# EAGLE design SNES_AddOn1Chip (EAGLE 6.5.0)
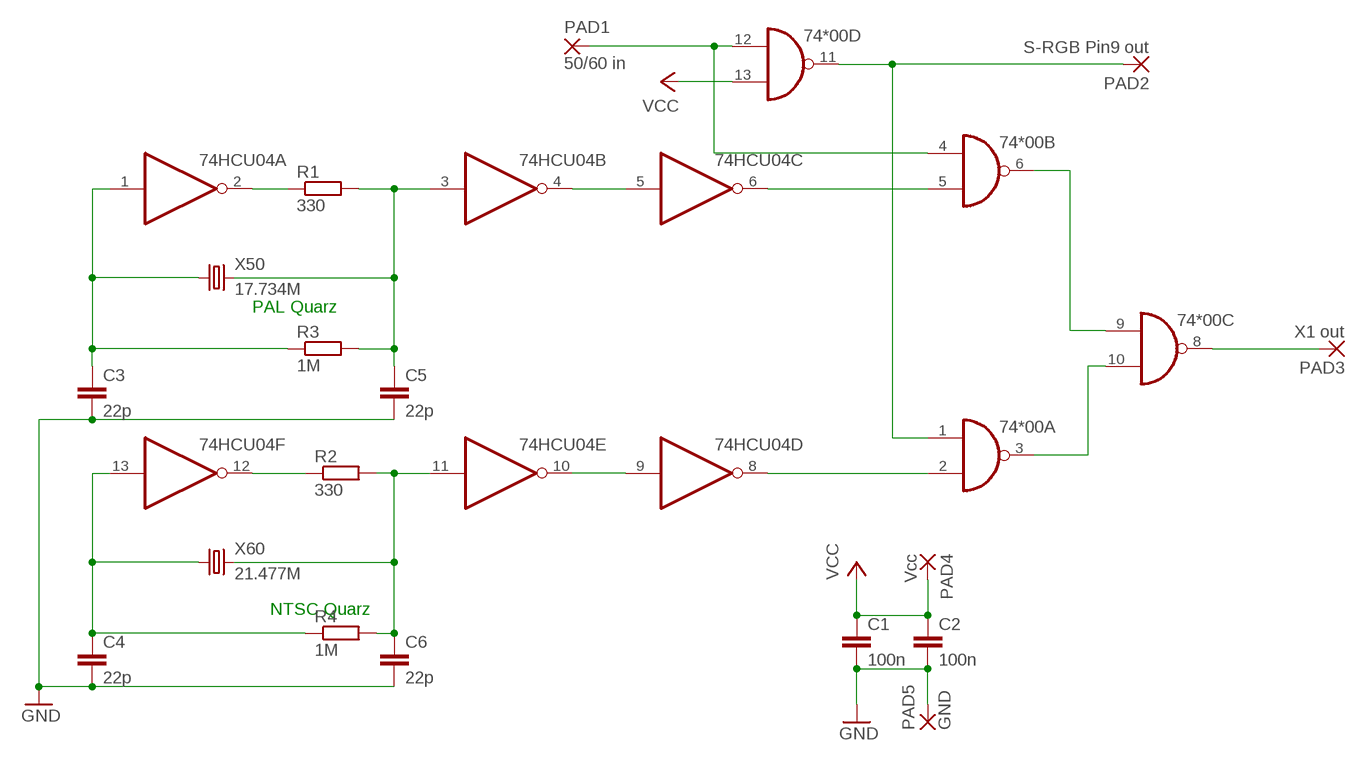
[diagram p0: schematic, sheet 1]

## Parts
74*00  7400D  [SO14]
74HCU04  74HC04D  [SO14]
C1  100n  C0805  [Z0805]
C2  100n  C0805  [Z0805]
C3  22p  C0805  [Z0805]
C4  22p  C0805  [Z0805]
C5  22p  C0805  [Z0805]
C6  22p  C0805  [Z0805]
PAD1  50/60 in  SMD2  [SMD1,27-2,54]
PAD2  S-RGB Pin9 out  SMD2  [SMD1,27-2,54]
PAD3  X1 out  SMD2  [SMD1,27-2,54]
PAD4  Vcc  SMD5  [SMD2,54-5,08]
PAD5  GND  SMD5  [SMD2,54-5,08]
R1  330  R0805  [Z0805]
R2  330  R0805  [Z0805]
R3  1M  R0805  [Z0805]
R4  1M  R0805  [Z0805]
X50  17.734M  CRYSTALHC49S  [HC49/S]
X60  21.477M  CRYSTALHC49S  [HC49/S]

## Nets
GND: C1.2 C2.2 C3.2 C4.2 C5.2 C6.2 PAD5.1(P)
N$27: 74HCU04.1(A:I) C3.1 R3.1 X50.1
N$28: 74HCU04.3(B:I) C5.1 R1.2 R3.2 X50.2
N$29: 74HCU04.13(F:I) C4.1 R4.1 X60.1
N$30: 74HCU04.11(E:I) C6.1 R2.2 R4.2 X60.2
N$31: 74*00.3(A:O) 74*00.10(C:I1)
N$32: 74*00.6(B:O) 74*00.9(C:I0)
N$33: 74*00.4(B:I0) 74*00.12(D:I0) PAD1.1(P)
N$35: 74*00.1(A:I0) 74*00.11(D:O) PAD2.1(P)
N$36: 74*00.8(C:O) PAD3.1(P)
N$37: 74HCU04.2(A:O) R1.1
N$38: 74HCU04.4(B:O) 74HCU04.5(C:I)
N$39: 74*00.5(B:I1) 74HCU04.6(C:O)
N$41: 74*00.2(A:I1) 74HCU04.8(D:O)
N$44: 74HCU04.9(D:I) 74HCU04.10(E:O)
N$50: 74HCU04.12(F:O) R2.1
VCC: 74*00.13(D:I1) C1.1 C2.1 PAD4.1(P)

## Notes on the sheet
- PAL Quarz
- NTSC Quarz

## Power pins joined to a net without a drawn wire
GND: 74*00.7(P:GND) 74HCU04.7(P:GND)
VCC: 74*00.14(P:VCC) 74HCU04.14(P:VCC)

## Library data of the parts
74*00 = 74xx-eu:74*00: Quad 2-input NAND gate
74HCU04 = 74xx-eu:74*04: Hex INVERTER
C1-C6 = snescart:C0805
PAD1-PAD3 = wirepad:SMD2: SMD PAD
PAD4 PAD5 = wirepad:SMD5: SMD PAD
R1-R4 = snescart:R0805
X50 X60 = crystal:CRYSTAL: CRYSTAL; OC_FARNELL: 1667008; OC_NEWARK: unknown

## Board
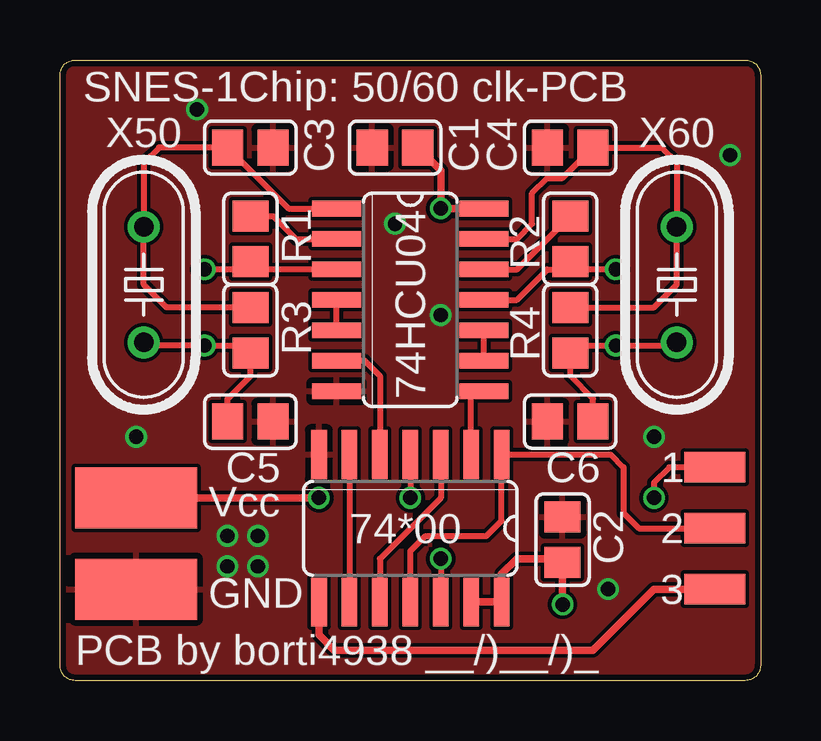
[diagram p1: board, top side]
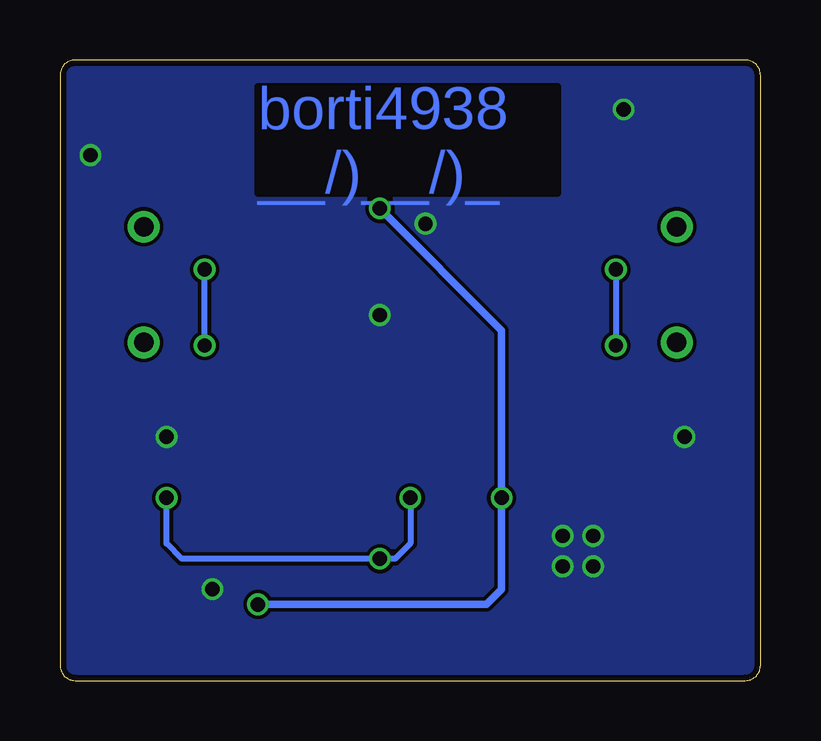
[diagram p2: board, bottom side, seen from below]

Size 29.21 x 25.88 mm. Coordinates in mm from the lower left corner, seen from the top.
Outline: 0.63,0 arc-90 0,0.63 0,25.24 arc-90 0.63,25.88 28.57,25.88 arc-90 29.21,25.24 29.21,0.63 arc-90 28.57,0 0.63,0
Copper layers (1*16): Top 0.035mm / dielectric 1.5mm / Bottom 0.035mm
Design rules "ITEADstudio_DRC": minimum track width 6mil, minimum drill 12mil, track to track 6mil, track to pad 6mil, pad to pad 6mil, via to via 6mil, smd to smd 0mil, copper to edge 10mil, drill to drill 10mil, minimum pad ring 10mil, minimum via ring 6mil, stop-mask expansion 2mil, vias tented up to drill 100mil, thermal gap 10mil

### Footprints (pad centres in the part's own frame; a part is rotated, then mirrored left to right if it is on the bottom)
SO14 = smd 0.66 x 2.032: 1 -3.81,-3.073; 2 -2.54,-3.073; 3 -1.27,-3.073; 4 0,-3.073; 5 1.27,-3.073; 6 2.54,-3.073; 7 3.81,-3.073; 8 3.81,3.073; 9 2.54,3.073; 10 1.27,3.073; 11 0,3.073; 12 -1.27,3.073; 13 -2.54,3.073; 14 -3.81,3.073
Z0805 = smd 1.3 x 1.5: 1 -0.95,0; 2 0.95,0
SMD1,27-2,54 = smd 1.27 x 2.54: 1 0,0
SMD2,54-5,08 = smd 2.54 x 5.08: 1 0,0
HC49/S = drill 0.813: 1 -2.413,0; 2 2.413,0

### Placement (x,y rotation side)
74*00  14.61,6.35 180 top
74HCU04  14.61,15.87 270 top
C1  13.97,22.22 180 top
C2  20.96,5.87 90 top
C3  7.94,22.22 0 top
C4  21.27,22.22 180 top
C5  7.94,10.79 0 top
C6  21.27,10.79 180 top
PAD1  27.3,8.89 90 top
PAD2  27.3,6.35 90 top
PAD3  27.3,3.81 90 top
PAD4  3.18,7.62 90 top
PAD5  3.18,3.81 90 top
R1  7.94,18.42 270 top
R2  21.27,18.42 270 top
R3  7.94,14.61 270 top
R4  21.27,14.61 270 top
X50  3.49,16.51 270 top
X60  25.72,16.51 270 top

### Tracks (layer width: path | path; a pad name or v marks a point on that pad's centre or on a via)
GND  (via drill 0.6)
  other vias: 6.98,4.76 15.88,15.24 13.97,19.05 27.94,21.91 3.18,10.16 24.76,10.16 22.86,3.81 5.71,23.81 6.98,6.03 8.25,4.76 8.25,6.03
  pour Top: -1.91,-1.27 31.11,-1.27 31.11,26.67 -1.91,26.67
  pour Bottom: -1.91,-1.27 31.11,-1.27 31.11,26.67 -1.91,26.67
N$27
  Top 0.254: R3.1 4.45,15.55 3.49,16.51 X50.1 3.49,21.59 4.13,22.22 C3.1 9.52,19.68 74HCU04.1
N$28  (via drill 0.6)
  Top 0.254: 74HCU04.3 8.26,17.14 | 8.26,17.14 R1.2 | 8.26,17.14 v6.03,17.14 | X50.2 3.62,13.97 v6.03,13.97 7.62,13.97 R3.2 7.94,12.7 6.99,11.75 C5.1
  Bottom 0.254: v6.03,17.14 v6.03,13.97
N$29
  Top 0.254: R4.1 24.76,15.55 25.72,16.51 X60.1 25.72,21.59 25.08,22.22 C4.1 20.95,20.96 20.32,20.96 19.68,20.32 19.68,19.05 19.05,18.42 74HCU04.13
N$30  (via drill 0.6)
  Top 0.254: R2.2 21.27,17.14 20.96,17.14 | v23.18,17.14 21.59,17.14 R2.2 | X60.2 25.59,13.97 v23.18,13.97 21.27,13.97 R4.2 21.27,12.7 22.22,11.75 C6.1 | 74HCU04.11 19.05,15.87 20.32,17.14 20.95,17.14 R2.2
  Bottom 0.254: v23.18,13.97 v23.18,17.14
N$31
  Top 0.254: 74*00.3 15.88,7.62 13.34,5.08 74*00.10
N$32
  Top 0.254: 74*00.6 74*00.9
N$33  (via drill 0.6)
  Top 0.254: v15.88,5.08 74*00.12 | 74*00.4 v14.61,7.62 | PAD1.1 25.4,8.89 24.76,8.25 v24.76,7.62
  Bottom 0.254: v14.61,7.62 14.61,5.71 15.24,5.08 v15.88,5.08 24.13,5.08 24.76,5.71 v24.76,7.62
N$35
  Top 0.254: 74*00.11 14.61,5.4 15.24,6.03 17.78,6.03 18.42,6.67 74*00.1 22.96,9.42 23.5,8.89 23.5,6.98 24.13,6.35 PAD2.1
N$36
  Top 0.305: PAD3.1 24.76,3.81 22.22,1.27 11.43,1.27 10.79,1.9 74*00.8
N$37
  Top 0.254: R1.1 8.89,19.36 9.84,18.42 74HCU04.2
N$38
  Top 0.254: 74HCU04.5 74HCU04.4
N$39
  Top 0.254: 74HCU04.6 12.7,13.33 13.34,12.7 74*00.5
N$41
  Top 0.254: 74*00.2 17.14,12.06 74HCU04.8
N$44
  Top 0.254: 74HCU04.9 74HCU04.10
N$50
  Top 0.254: 74HCU04.12 19.05,17.14 R2.1
VCC  (via drill 0.6)
  Top 0.305: 74*00.13 74*00.14 18.42,4.45 19.05,5.08 20.64,5.08 C2.1 v20.96,3.18 | 74HCU04.14 v15.88,19.68 15.88,21.27 C1.1 | PAD4.1 v10.79,7.62
  Bottom 0.305: v20.96,3.18 11.43,3.18 10.79,3.81 v10.79,7.62 10.79,14.61 v15.88,19.68

### Text on the board
Bottom: borti4938 / __/)__/)_
tNames: SNES-1Chip: 50/60 clk-PCB | C3 | C1 | C4 | X50 | X60 | R1 | R2 | R3 | R4 | 74HCU04 | C5 | C6 | 1 | Vcc | C2 | 2 | 74*00 | 3 | GND | PCB by borti4938 __/)__/)_